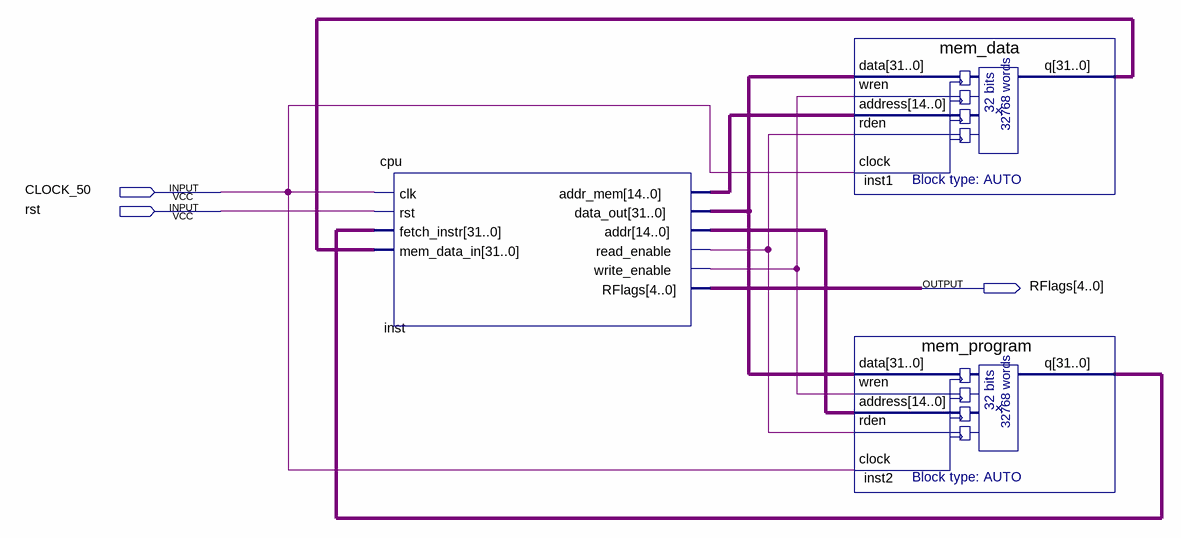
[diagram p0: schematic sheet]
// Quartus schematic processor.bdf as structural Verilog: 3 symbols, 3 pins
module processor (
  input  CLOCK_50,
  input  rst,
  output [4:0] RFlags
);

  wire inst_read_enable, inst_write_enable;
  wire [14:0] inst_addr, inst_addr_mem;
  wire [31:0] inst1_q, inst2_q, inst_data_out;

  cpu inst (
    .clk(CLOCK_50), .rst(rst), .fetch_instr(inst2_q), .mem_data_in(inst1_q), .addr_mem(inst_addr_mem),
    .data_out(inst_data_out), .addr(inst_addr), .read_enable(inst_read_enable),
    .write_enable(inst_write_enable), .RFlags(RFlags));
  mem_data inst1 (
    .data(inst_data_out), .wren(inst_write_enable), .address(inst_addr_mem), .rden(inst_read_enable),
    .clock(CLOCK_50), .q(inst1_q));
  mem_program inst2 (
    .data(inst_data_out), .wren(inst_write_enable), .address(inst_addr), .rden(inst_read_enable),
    .clock(CLOCK_50), .q(inst2_q));
endmodule
